# Altium schematic sheet TIDA-00641_BlankSheet.SchDoc
size 431 x 279 mm; Date: Not shown in title block; ApprovedBy: Not shown in title block; CheckedBy: Not shown in title block; Author: Not shown in title block; CompanyName: Not shown in title block; Engineer: Not shown in title block; Organization: Not shown in title block; Address1: Not shown in title block; Address2: Not shown in title block; Address3: Not shown in title block; Address4: Not shown in title block; DocumentNumber: 1; Revision: Use project parameter SCH_Rev; SheetNumber: 2; SheetTotal: 3; PageSetup: Record=PageOptions|CenterHorizontal=True|CenterVertical=True|PrintScale=1.00|XCorrection=1.00|YCorrection=1.00|PrintKind=0|BorderSize=5000000|LeftOffset=0|BottomOffset=0|Orientation=2|PaperLength=1000|PaperWidth=1000|Scale=100|PaperSource=15|PrintQuality=600|MediaType=1|DitherType=10|PaperKind=Letter|PrintScaleMode=1; CurrentTime: Not shown in title block; CurrentDate: Not shown in title block; Time: Not shown in title block; DocumentFullPathAndName: Not shown in title block; DocumentName: Not shown in title block; ModifiedDate: Not shown in title block; ImagePath: Not shown in title block
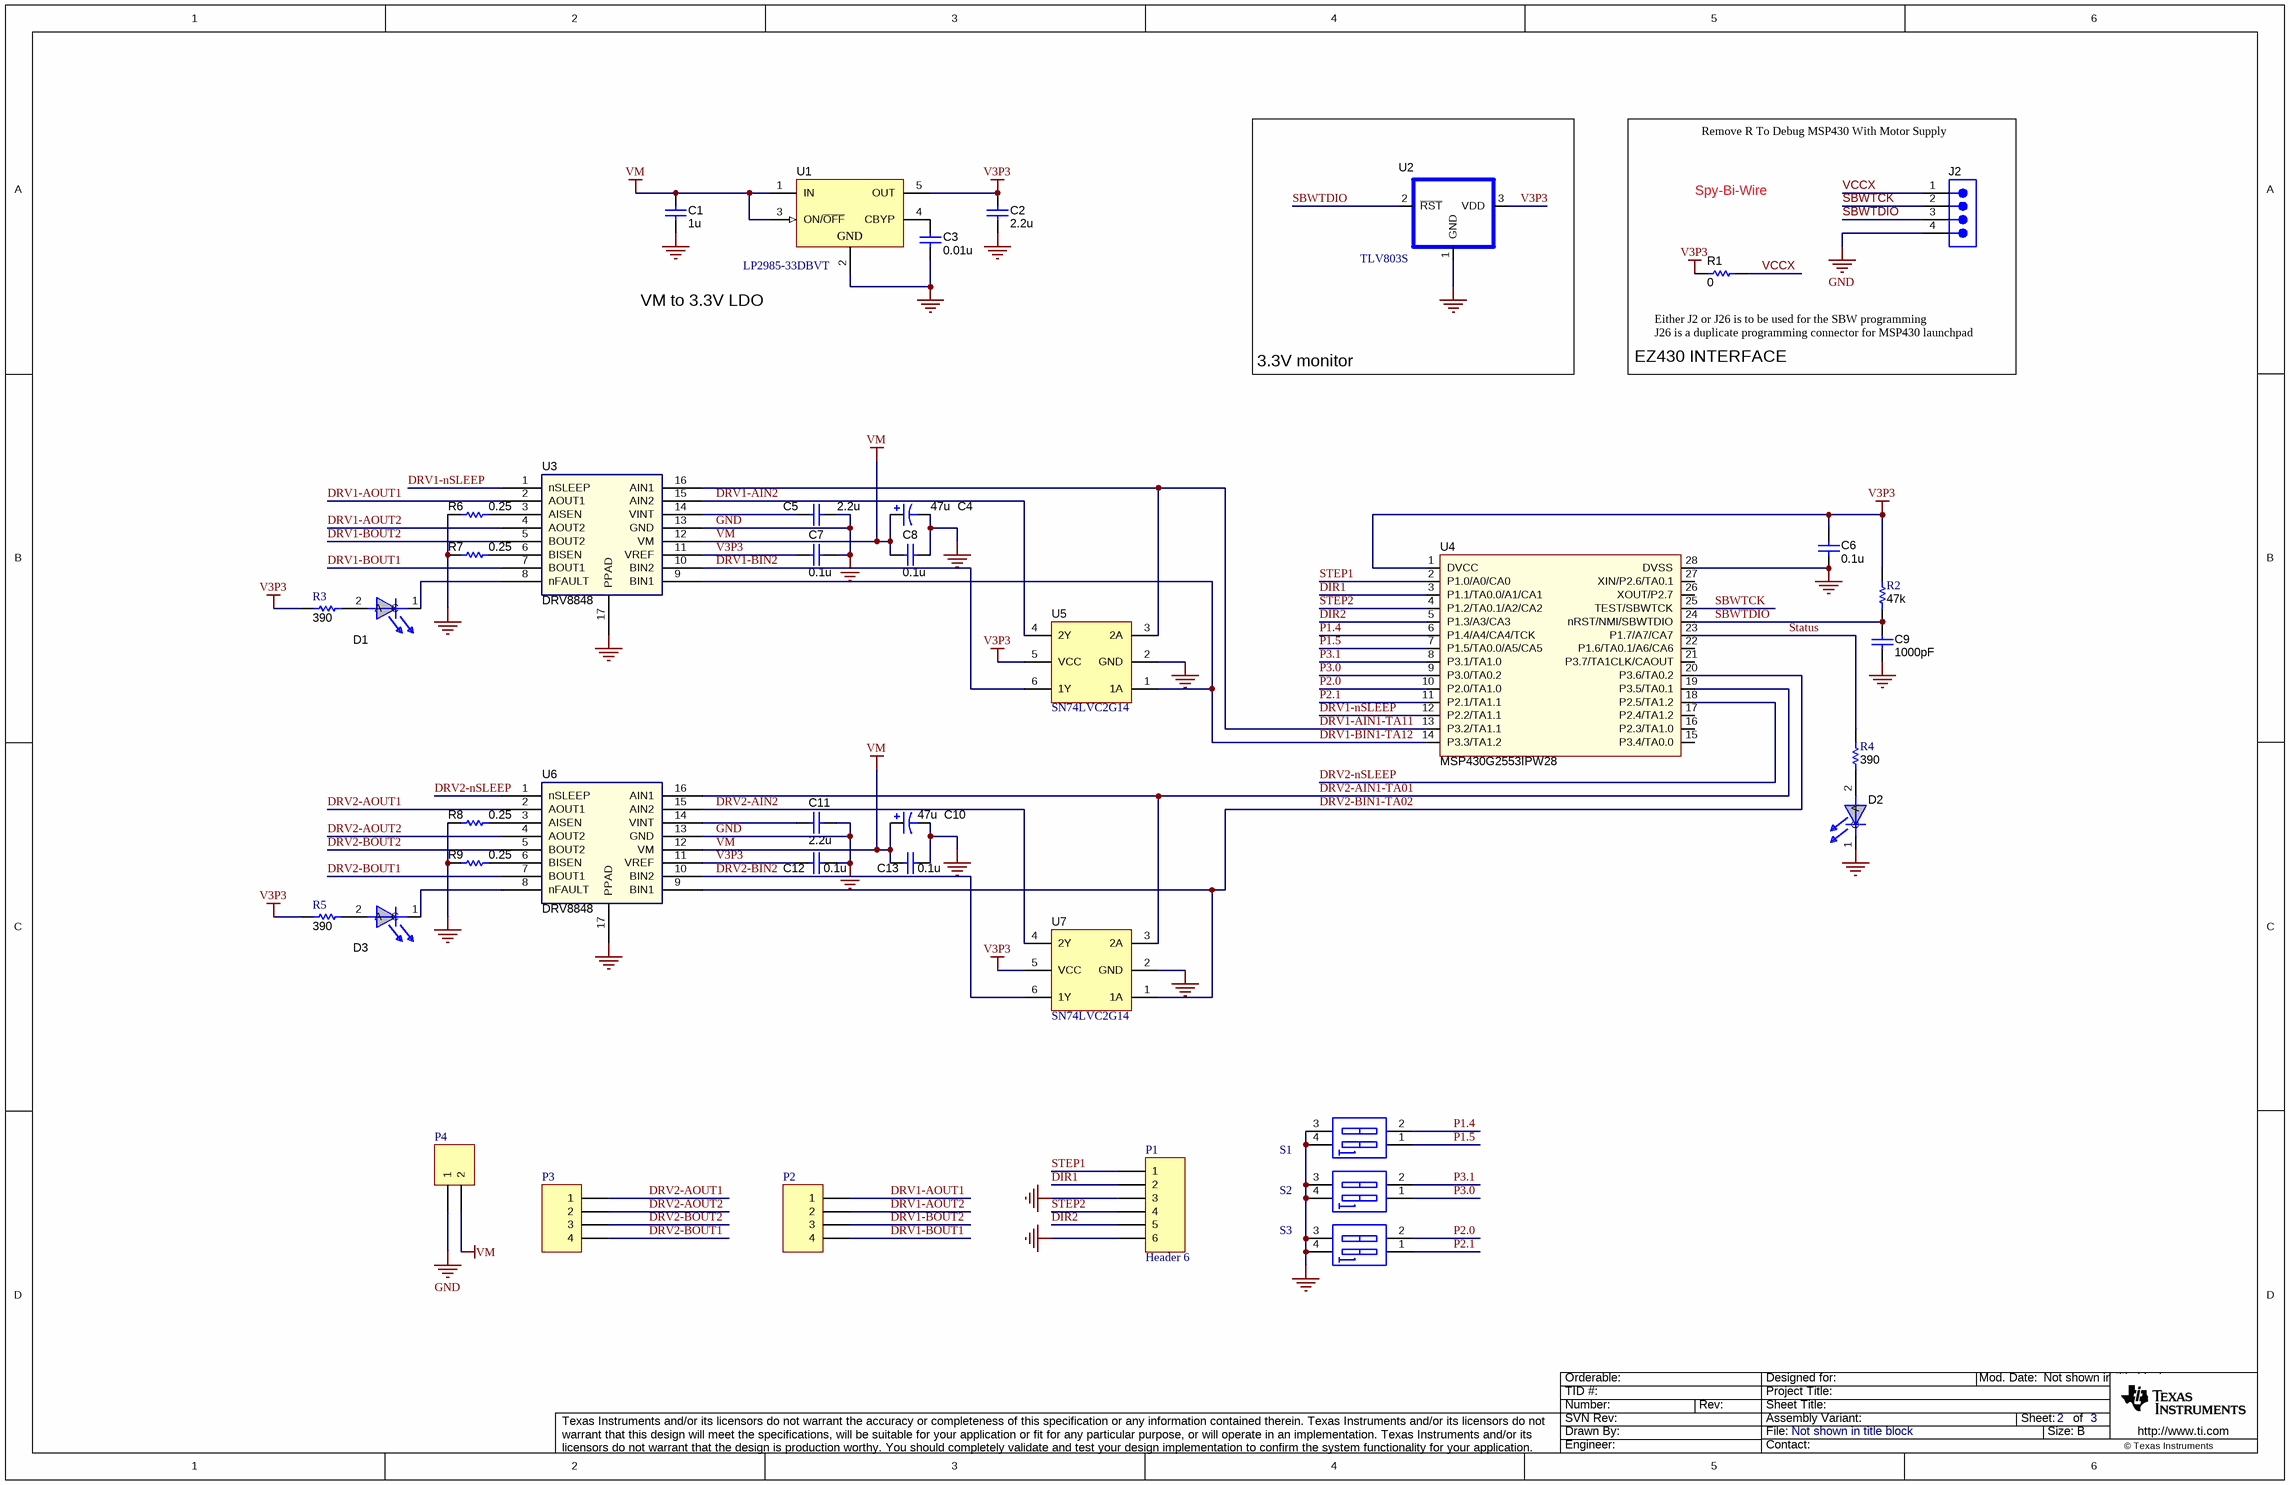
[diagram p0: TIDA-00641_BlankSheet.SchDoc]

## Parts
C1  ValueDisplayed: 1u  [0603L]  (hidden comment: C0603C105K4PACTU)
C2  ValueDisplayed: 2.2u  [0603L]  (hidden comment: C0603C225K8PACTU)
C3  ValueDisplayed: 0.01u  [0603L]  (hidden comment: C0603C103J5RACTU)
C4  ValueDisplayed: 47u  [SM_RADIAL_D]  (hidden comment: EEE-FK1E470P)
C5  ValueDisplayed: 2.2u  [0603L]  (hidden comment: C0603C225M8PACTU)
C6  ValueDisplayed: 0.1u  [0603L]  (hidden comment: C0603C104K4RACTU)
C7  ValueDisplayed: 0.1u  [0603L]  (hidden comment: 06033C104KAT2A)
C8  ValueDisplayed: 0.1u  [0603L]  (hidden comment: 06033C104KAT2A)
C9  ValueDisplayed: 1000pF  [0603L]  (hidden comment: C0603C102K5RACTU)
C10  ValueDisplayed: 47u  [SM_RADIAL_D]  (hidden comment: EEE-FK1E470P)
C11  ValueDisplayed: 2.2u  [0603L]  (hidden comment: C0603C225K8PACTU)
C12  ValueDisplayed: 0.1u  [0603L]  (hidden comment: 06033C104KAT2A)
C13  ValueDisplayed: 0.1u  [0603L]  (hidden comment: 06033C104KAT2A)
D1  LTST-C190KRKT  [LED603RED]  (value not drawn)
D2  LTST-C190GKT  [LED603GRN]  (value not drawn)
D3  LTST-C190KRKT  [LED603RED]  (value not drawn)
J2  TSW-104-07-G-S  [HDR1X4]  (value not drawn)
P1  Header 6  [HDR1X6]
P2  Header 4  [J4-3.81]  (value not drawn)
P3  Header 4  [J4-3.81]  (value not drawn)
P4  Header 2  [j2-3.81]  (value not drawn)
R1  value 0  [0603L]  (hidden comment: ERJ-3GEY0R00V)
R2  value 47k  [0603L]  (hidden comment: CRCW060347K0JNEA)
R3  value 390  [0603L]  (hidden comment: RC0603FR-07390RL)
R4  value 390  [0603L]  (hidden comment: RC0603FR-07390RL)
R5  value 390  [0603L]  (hidden comment: RC0603FR-07390RL)
R6  value 0.25  [2512M]  (hidden comment: CSRN2512FKR250)
R7  value 0.25  [2512M]  (hidden comment: CSRN2512FKR250)
R8  value 0.25  [2512M]  (hidden comment: CSRN2512FKR250)
R9  value 0.25  [2512M]  (hidden comment: CSRN2512FKR250)
S1  SW DIP-2  [DIP-4]  (value not drawn)
S2  SW DIP-2  [DIP-4]  (value not drawn)
S3  SW DIP-2  [DIP-4]  (value not drawn)
U1  LP2985-33DBVT  [MF05A_L]
U2  TLV803S  [SOT-23]
U3  DRV8848  [PW0016S]
U4  MSP430G2553IPW28  [PW0028A_N]
U5  SN74LVC2G14  [DBV0006A_N]
U6  DRV8848  [PW0016S]
U7  SN74LVC2G14  [DBV0006A_N]

## Blocks framed on the sheet
3.3V monitor: U2
EZ430 INTERFACE: J2 R1

## Nets
GND: C1.2 C2.1 C3.2 C4.2(-) C5.2 C6.1 C7.1 C8.1 C9.1 C10.2(-) C11.2 C12.1 C13.1 D2.1(C) J2.4 P1.3 P1.6 P4.1 R6.1 R7.1 R8.1 R9.1 S1.3(B2) S1.4(B1) S2.3(B2) S2.4(B1) S3.3(B2) S3.4(B1) U1.2(GND) U2.1(GND) U3.13(GND) U3.17(PPAD) U4.28(DVSS) U5.2(GND) U6.13(GND) U6.17(PPAD) U7.2(GND)
V3P3: C2.2 C6.2 C7.2 C12.2 R1.1 R2.1 R3.2 R5.2 U1.5(OUT) U2.3(VDD) U3.11(VREF) U4.1(DVCC) U5.5(VCC) U6.11(VREF) U7.5(VCC)
VM: C1.1 C4.1(+) C8.2 C10.1(+) C13.2 P4.2 U1.1(IN) U1.3(ON/~{OFF}) U3.12(VM) U6.12(VM)
DIR1: P1.2 U4.3(P1.1/TA0.0/A1/CA1)
DIR2: P1.5 U4.5(P1.3/A3/CA3)
DRV1-AIN1-TA11: U3.16(AIN1) U4.13(P3.2/TA1.1) U5.3(2A)
DRV1-AIN2: U3.15(AIN2) U5.4(2Y)
DRV1-AOUT1: P2.1 U3.2(AOUT1)
DRV1-AOUT2: P2.2 U3.4(AOUT2)
DRV1-BIN1-TA12: U3.9(BIN1) U4.14(P3.3/TA1.2) U5.1(1A)
DRV1-BIN2: U3.10(BIN2) U5.6(1Y)
DRV1-BOUT1: P2.4 U3.7(BOUT1)
DRV1-BOUT2: P2.3 U3.5(BOUT2)
DRV1-nSLEEP: U3.1(nSLEEP) U4.12(P2.2/TA1.1)
DRV2-AIN1-TA01: U4.19(P3.5/TA0.1) U6.16(AIN1) U7.3(2A)
DRV2-AIN2: U6.15(AIN2) U7.4(2Y)
DRV2-AOUT1: P3.1 U6.2(AOUT1)
DRV2-AOUT2: P3.2 U6.4(AOUT2)
DRV2-BIN1-TA02: U4.20(P3.6/TA0.2) U6.9(BIN1) U7.1(1A)
DRV2-BIN2: U6.10(BIN2) U7.6(1Y)
DRV2-BOUT1: P3.4 U6.7(BOUT1)
DRV2-BOUT2: P3.3 U6.5(BOUT2)
DRV2-nSLEEP: U4.18(P2.5/TA1.2) U6.1(nSLEEP)
P1.4: S1.2(A2) U4.6(P1.4/A4/CA4/TCK)
P1.5: S1.1(A1) U4.7(P1.5/TA0.0/A5/CA5)
P2.0: S3.2(A2) U4.10(P2.0/TA1.0)
P2.1: S3.1(A1) U4.11(P2.1/TA1.1)
P3.0: S2.1(A1) U4.9(P3.0/TA0.2)
P3.1: S2.2(A2) U4.8(P3.1/TA1.0)
SBWTCK: J2.2 U4.25(TEST/SBWTCK)
SBWTDIO: C9.2 J2.3 R2.2 U2.2(~{RST}) U4.24(nRST/NMI/SBWTDIO)
Status: R4.2 U4.23(P1.7/A7/CA7)
STEP1: P1.1 U4.2(P1.0/A0/CA0)
STEP2: P1.4 U4.4(P1.2/TA0.1/A2/CA2)
VCCX: J2.1 R1.2
NetC3_1: C3.1 U1.4(CBYP)
NetC5_1: C5.1 U3.14(VINT)
NetC11_1: C11.1 U6.14(VINT)
NetD1_1: D1.1(C) U3.8(nFAULT)
NetD1_2: D1.2(A) R3.1
NetD2_2: D2.2(A) R4.1
NetD3_1: D3.1(C) U6.8(nFAULT)
NetD3_2: D3.2(A) R5.1
NetR6_2: R6.2 U3.3(AISEN)
NetR7_2: R7.2 U3.6(BISEN)
NetR8_2: R8.2 U6.3(AISEN)
NetR9_2: R9.2 U6.6(BISEN)

Not connected (* = marked no-connect by the designer): U4 15(P3.4/TA0.0) 16(P2.3/TA1.0) 17(P2.4/TA1.2) 21(P3.7/TA1CLK/CAOUT) 22(P1.6/TA0.1/A6/CA6) 26(XOUT/P2.7) 27(XIN/P2.6/TA0.1)

## Notes on the sheet
- Remove R To Debug MSP430 With Motor Supply
- Spy-Bi-Wire
- VM to 3.3V LDO
- (near R1) Either J2 or J26 is to be used for the SBW programming
- J26 is a duplicate programming connector for MSP430 launchpad
- Drawn By:
- SVN Rev:
- Number:
- TID #:
- Orderable:
- Rev:
- Sheet Title:
- File:
- Project Title:
- Designed for:
- Assembly Variant:
- Mod. Date:
- Sheet:
- Size:
- of
- B
- http://www.ti.com
- Texas Instruments and/or its licensors do not warrant the accuracy or completeness of this specification or any information contained therein. Texas Instruments and/or its licensors do not warrant that this design will meet the specifications, will be suitable for your application or fit for any particular purpose, or will operate in an implementation. Texas Instruments and/or its licensors do not warrant that the design is production worthy. You should completely validate and test your design implementation to confirm the system functionality for your application.
- Engineer:
- Contact:
- © Texas Instruments

## Library data of the parts
C1 = C0603C105K4PACTU: CAP, CERM, 1uF, 16V, +/-10%, X5R, 0603; Manufacturer: Kemet; Polarized: N; CompType: Capacitor; U/M: EA; Cap_F: 0.000001; Tolerance_%: 10; Value1: Unknown; VDC_V: 16; TaMin_C: -55; TaMax_C: 85; Cap_Case: 0603; Value: 1uF; SymbolVersion: 2008-07-09; PartNumber: C0603C105K4PACTU; PackageReference: 0603; RoHS: Y; Value2: 16V; MountType: SMT; Technology: Ceramic; TempCo: X5R; Published: 2008-06-19; Publisher: Texas Instruments; LatestRevisionDate: 2013-03-13; ComponentLink1Description: Datasheet link; ComponentLink1URL: http://www.kemet.com/kemet/web/homepage/kechome.nsf/vapubfiles/F3102_Y5V.pdf/$file/F3102_Y5V.pdf; Supplier 1: Digi-Key; Supplier Part Number 1: 399-5090-1-ND; Supplier 2: Mouser; Supplier Part Number 2: 80-C0603C105K4P; Supplier 3: Farnell; Supplier Part Number 3: 1288256; LatestRevisionNote: Changed publisher
C2 C11 = C0603C225K8PACTU: CAP, CERM, 2.2uF, 10V, +/-10%, X5R, 0603; Manufacturer: Kemet; Polarized: N; CompType: Capacitor; U/M: EA; Cap_F: 0.0000022; Tolerance_%: 10; Value1: Unknown; TaMin_C: -55; TaMax_C: 85; Cap_Case: 0603; SymbolVersion: 2008-07-09; Value: 2.2uF; PartNumber: C0603C225K8PACTU; PackageReference: 0603; RoHS: Y; VDC_V: 10; Value2: 10V; MountType: SMT; Technology: Ceramic; TempCo: X5R; Published: 2008-06-19; Publisher: Texas Instruments; LatestRevisionDate: 2013-03-13; ComponentLink1Description: Datasheet link; ComponentLink1URL: http://www.kemet.com/kemet/web/homepage/kechome.nsf/vapubfiles/F3102_Y5V.pdf/$file/F3102_Y5V.pdf; Supplier 1: Digi-Key; Supplier Part Number 1: 399-4911-1-ND; Supplier 2: Mouser; Supplier Part Number 2: 80-C0603C225K8P; Supplier 3: Farnell; Supplier Part Number 3: 1108322; LatestRevisionNote: Changed publisher
C3 = C0603C103J5RACTU: CAP, CERM, 0.01uF, 50V, +/-5%, X7R, 0603; Manufacturer: Kemet; Polarized: N; CompType: Capacitor; U/M: EA; Cap_F: 0.00000001; Tolerance_%: 5; Value1: Unknown; VDC_V: 50; TaMin_C: -55; TaMax_C: 125; Cap_Case: 0603; Value: 0.01uF; SymbolVersion: 2008-07-09; PartNumber: C0603C103J5RACTU; PackageReference: 0603; RoHS: Y; Value2: 50V; MountType: SMT; Technology: Ceramic; TempCo: X7R; Published: 2008-06-19; Publisher: Texas Instruments; LatestRevisionDate: 2013-03-13; ComponentLink1Description: Datasheet link; ComponentLink1URL: http://www.kemet.com/kemet/web/homepage/kechome.nsf/vapubfiles/F3102_Y5V.pdf/$file/F3102_Y5V.pdf; Supplier 1: Digi-Key; Supplier Part Number 1: 399-1092-1-ND; Supplier 2: Mouser; Supplier Part Number 2: 80-C0603C103J5R; Supplier 3: Farnell; Supplier Part Number 3: 1650831; LatestRevisionNote: Changed publisher
C4 C10 = EEE-FK1E470P: CAP, AL, 47uF, 25V, +/-20%, 0.36 ohm, SMD; Manufacturer: Panasonic; Polarized: Y; CompType: Capacitor; U/M: EA; Cap_F: 0.000047; Tolerance_%: 20; ESR_Ohm: 0.36; VDC_V: 25; IRMS_A: 0.24; TaMin_C: -55; TaMax_C: 105; Cap_Case: D; LatestRevisionDate: 2013-03-19; PackageReference: SMT Radial D; Publisher: Texas Instruments; Value: 47uF; SymbolVersion: 2008-07-09; PartNumber: EEE-FK1E470P; RoHS: Y; Value1: 0.36 ohm; Value2: 25V; MountType: SMT; Technology: AL; ComponentLink1Description: Datasheet link; ComponentLink1URL: http://www.panasonic.com/industrial/components/pdf/smt_aec_050505.pdf; Supplier 1: Digi-Key; Supplier Part Number 1: PCE3804CT-ND; Supplier 2: Mouser; Supplier Part Number 2: 667-EEE-FK1E470P; Supplier 3: Farnell; Supplier Part Number 3: 9695753; Series: FK
C5 = C0603C225M8PACTU: CAP, CERM, 2.2uF, 10V, +/-20%, X5R, 0603; Manufacturer: Kemet; Polarized: N; CompType: Capacitor; U/M: EA; Cap_F: 0.0000022; Tolerance_%: 20; Value1: Unknown; VDC_V: 10; TaMin_C: -55; TaMax_C: 85; Cap_Case: 0603; SymbolVersion: 2008-07-09; Value: 2.2uF; PartNumber: C0603C225M8PACTU; PackageReference: 0603; RoHS: Y; Value2: 10V; MountType: SMT; Technology: Ceramic; TempCo: X5R; Published: 2008-06-19; Publisher: Texas Instruments; LatestRevisionDate: 2013-03-13; ComponentLink1Description: Datasheet link; ComponentLink1URL: http://www.kemet.com/kemet/web/homepage/kechome.nsf/vapubfiles/F3102_Y5V.pdf/$file/F3102_Y5V.pdf; Supplier 1: Digi-Key; Supplier Part Number 1: 399-4912-1-ND; Supplier 2: Mouser; Supplier Part Number 2: 80-C0603C225M8P; LatestRevisionNote: Changed publisher
C6 = C0603C104K4RACTU: CAP, CERM, 0.1uF, 16V, +/-10%, X7R, 0603; Manufacturer: Kemet; Polarized: N; CompType: Capacitor; U/M: EA; Cap_F: 0.0000001; Tolerance_%: 10; Value1: Unknown; VDC_V: 16; TaMin_C: -55; TaMax_C: 125; Cap_Case: 0603; Value: 0.1uF; SymbolVersion: 2008-07-09; PartNumber: C0603C104K4RACTU; PackageReference: 0603; RoHS: Y; Value2: 16V; MountType: SMT; Technology: Ceramic; TempCo: X7R; Published: 2008-06-19; Publisher: Texas Instruments; LatestRevisionDate: 2013-03-13; ComponentLink1Description: Datasheet link; ComponentLink1URL: http://www.kemet.com/kemet/web/homepage/kechome.nsf/vapubfiles/F3102_Y5V.pdf/$file/F3102_Y5V.pdf; Supplier 1: Digi-Key; Supplier Part Number 1: 399-1096-1-ND; Supplier 2: Mouser; Supplier Part Number 2: 80-C0603C104K4R; Supplier 3: Farnell; Supplier Part Number 3: 1414610; LatestRevisionNote: Changed publisher
C7 C8 C12 C13 = 06033C104KAT2A: CAP, CERM, 0.1uF, 25V, +/-10%, X7R, 0603; Manufacturer: AVX; Polarized: N; CompType: Capacitor; U/M: EA; Cap_F: 0.0000001; Tolerance_%: 10; ESR_Ohm: 0.05; Value1: 0.05 ohm; VDC_V: 25; TaMin_C: -55; TaMax_C: 125; Cap_Case: 0603; Value: 0.1uF; SymbolVersion: 2008-07-09; PartNumber: 06033C104KAT2A; PackageReference: 0603; RoHS: Y; Value2: 25V; MountType: SMT; Technology: Ceramic; TempCo: X7R; Published: 2008-06-19; Publisher: Texas Instruments; LatestRevisionDate: 2013-03-13; ComponentLink1Description: Datasheet link; ComponentLink1URL: http://www.avx.com/docs/masterpubs/smccp.pdf; Supplier 1: Digi-Key; Supplier Part Number 1: 478-3714-1-ND; Supplier 2: Mouser; Supplier Part Number 2: 581-06033C104KAT2A; Supplier 3: Farnell; Supplier Part Number 3: 1396406; LatestRevisionNote: Changed publisher
C9 = C0603C102K5RACTU: CAP, CERM, 1000pF, 50V, +/-10%, X7R, 0603; Manufacturer: Kemet; Polarized: N; CompType: Capacitor; U/M: EA; Cap_F: 0.000000001; Tolerance_%: 10; Value1: Unknown; VDC_V: 50; TaMin_C: -55; TaMax_C: 125; Cap_Case: 0603; Value: 1000pF; SymbolVersion: 2008-07-09; PartNumber: C0603C102K5RACTU; PackageReference: 0603; RoHS: Y; Value2: 50V; MountType: SMT; Technology: Ceramic; TempCo: X7R; Published: 2008-06-19; Publisher: Texas Instruments; LatestRevisionDate: 2013-03-13; ComponentLink1Description: Datasheet link; ComponentLink1URL: http://www.kemet.com/kemet/web/homepage/kechome.nsf/vapubfiles/F3102_Y5V.pdf/$file/F3102_Y5V.pdf; Supplier 1: Digi-Key; Supplier Part Number 1: 399-1082-1-ND; Supplier 2: Mouser; Supplier Part Number 2: 80-C0603C102K5R; Supplier 3: Farnell; Supplier Part Number 3: 1414608; LatestRevisionNote: Changed publisher
D1 D3 = D_LED_603_GRN: LED SUPER RED CLEAR 0603 SMD; Manufacturer: Lite On; Value: LTST-C190GKT; Area: 9451; PartNumber: LTST-C190KRKT; SymbolVersion: 11/01/2006 14:12:06; PackageReference: 603; ComponentLink1URL: \\vette02\pmp_pcb\pcad_pdf's\c190.pdf; ComponentLink1Description: AEO Datasheet Link; ComponentHeight: 0.031 inch; Supplier 1: Digi-key; Supplier Part Number 1: 160-1436-1-ND
D2 = D_LED_603_GRN: Diode, LED, Green, 2.1-V, 20-mA, 6-mcd; Manufacturer: Lite On; Area: 9451; PartNumber: LTST-C190GKT; SymbolVersion: 11/01/2006 14:12:06; Value: LTST-C190GKT; PackageReference: 603; ComponentLink1URL: \\vette02\pmp_pcb\pcad_pdf's\c190.pdf; ComponentLink1Description: AEO Datasheet Link; ComponentHeight: 0.031 inch; Supplier 1: Digi-key; Supplier Part Number 1: 160-1183-1-ND
J2 = TSW-104-07-G-S: Header, TH, 100mil, 4x1, Gold plated, 230 mil above insulator; Manufacturer: Samtec, Inc.; SymbolCreator: a0412235; U/M: EA; LatestRevisionDate: 2013-03-28; Publisher: Texas Instruments; SymbolVersion: 2013-03-16; PartNumber: TSW-104-07-G-S; ClassName: Header; CompType: Header; RoHS: Y; PackageReference: TSW-104-07-G-S; MountType: TH; ComponentLink1Description: Datasheet Link; ComponentLink1URL: http://samtec.com/ftppub/pdf/TSW_TH.PDF; Supplier 1: Digi-Key; Supplier Part Number 1: SAM1029-04-ND
P1 = Header 6: Header, 6-Pin; LatestRevisionDate: 17-Jul-2002; LatestRevisionNote: Re-released for DXP Platform.; Publisher: Altium Limited
P2 P3 = Header 4: Header, 4-Pin; LatestRevisionDate: 17-Jul-2002; LatestRevisionNote: Re-released for DXP Platform.; Publisher: Altium Limited
P4 = Header 2: Header, 2-Pin; LatestRevisionDate: 17-Jul-2002; LatestRevisionNote: Re-released for DXP Platform.; Publisher: Altium Limited
R1 = ERJ-3GEY0R00V: RES, 0 ohm, 5%, 0.1W, 0603; Manufacturer: Panasonic; CompType: Resistor; Value_Code: 0000; Tolerance_%: 5; Power_W: 0.1; VDC_V: 50; TempCo: 600 ppm/C; EIA_Code: E24; U/M: EA; SymbolVersion: 2009-05-29; PartNumber: ERJ-3GEY0R00V; PackageReference: 0603; RoHS: Y; Res_ohm: 0; Value1: 5%; Value2: 0.1W; MountType: SMT; Technology: Thick Film; Published: 2008-06-26; Publisher: Texas Instruments; LatestRevisionDate: 2013-01-08; ComponentLink1Description: Datasheet link; ComponentLink1URL: http://www.panasonic.com/industrial/components/pdf/AOA0000CE1.pdf; Supplier 1: Digi-Key; Supplier Part Number 1: P0.0GCT-ND; Supplier 2: Mouser; Supplier Part Number 2: 667-ERJ-3GEY0R00V; Supplier 3: Farnell; Supplier Part Number 3: 2059527
R2 = CRCW060347K0JNEA: RES, 47k ohm, 5%, 0.1W, 0603; Manufacturer: Vishay-Dale; CompType: Resistor; Res_ohm: 47000; Value_Code: 47k0; Tolerance_%: 5; Power_W: 0.1; VDC_V: 75; TempCo: 200 ppm/C; EIA_Code: E24; U/M: EA; SymbolVersion: 2009-05-29; PartNumber: CRCW060347K0JNEA; PackageReference: 0603; RoHS: Y; Value1: 5%; Value2: 0.1W; MountType: SMT; Technology: Thick Film; Published: 2008-06-26; Publisher: Texas Instruments; LatestRevisionDate: 2014-01-08; ComponentLink1Description: Datasheet link; ComponentLink1URL: http://www.vishay.com/docs/20035/dcrcwe3.pdf; Supplier 1: Digi-Key; Supplier Part Number 1: 541-47KGCT-ND; Supplier 2: Mouser; Supplier Part Number 2: 71-CRCW060347K0JNEA; Supplier 3: Farnell; Supplier Part Number 3: 1652881
R3-R5 = RC0603FR-07390RL: RES, 390 ohm, 1%, 0.1W, 0603; Manufacturer: Yageo America; CompType: Resistor; Value_Code: 390R; Tolerance_%: 1; Power_W: 0.1; VDC_V: 150; TempCo: 200 ppm/C; U/M: EA; SymbolVersion: 2009-05-29; PartNumber: RC0603FR-07390RL; PackageReference: 0603; RoHS: Y; Res_ohm: 390; Value1: 1%; Value2: 0.1W; MountType: SMT; Technology: Thick Film; Published: 2008-06-26; Publisher: Texas Instruments; LatestRevisionDate: 2014-01-08; ComponentLink1Description: Datasheet link; ComponentLink1URL: http://www.yageo.com/pdf/Pu-RC0603_51_PbFree_L_2.pdf; Supplier 1: Digi-Key; Supplier Part Number 1: 311-390HRCT-ND; Supplier 2: Mouser; Supplier Part Number 2: 603-RC0603FR-07390RL; Supplier 3: Farnell; Supplier Part Number 3: 9238433
R6-R9 = CSRN2512FKR250: RES, 0.25 ohm, 1%, 2W, 2512; Manufacturer: Stackpole Electronics Inc; CompType: Resistor; Value_Code: R250; Tolerance_%: 1; Power_W: 2; TempCo: 200 ppm/C; U/M: EA; SymbolVersion: 2009-05-29; PartNumber: CSRN2512FKR250; PackageReference: 2512; RoHS: Y; Res_ohm: 0.25; Value1: 1%; Value2: 2W; MountType: SMT; Technology: Thick Film; Published: 2008-06-26; Publisher: Texas Instruments; LatestRevisionDate: 2013-12-20; ComponentLink1Description: Datasheet link; ComponentLink1URL: http://www.seielect.com/Catalog/SEI-csr.pdf; Supplier 1: Digi-Key; Supplier Part Number 1: CSRN2512FKR250CT-ND
S1-S3 = SW DIP-2: SWITCH TIN CONT 2 SEC 50V; Published: 24-Mar-1999; LatestRevisionDate: 17-Jul-2002; LatestRevisionNote: Re-released for DXP Platform.; PackageReference: DIP-4; Publisher: Altium Limited; Supplier 1: Digi-key; Supplier Part Number 1: CT2082-ND
U1 = LP2985IM5-3.3: Micropower 150 mA Low-Noise Ultra Low-Dropout Regulator, 5-pin SOT-23; Manufacturer: National Semiconductor; PackageTopMarking: L0RB*XTT; PowerWise: N; CompType: LDO IC; Publisher: Altium Limited; Published: 4-Dec-2008; DatasheetVersion: Jul-2007; PackageVersion: revD, Aug-2008; PackageReference: MF05A; PackageDescription: Molded SOT-23, .115 x .063 x .040 in Body, 5 Lead, .0375 in Pitch; Supplier 1: Farnell; Supplier Part Number 1: 9778284; PartNumber: LP2985IM5-3.3; RoHS: N; PinCount: 5; ComponentLink1Description: LP2985 Datasheet; ComponentLink1URL: http://www.national.com/ds/LP/LP2985.pdf; ComponentLink2Description: LP2985 Web Page; ComponentLink2URL: http://www.national.com/pf/LP/LP2985.html; ComponentLink3Description: MF05A Package Page; ComponentLink3URL: http://www.national.com/packaging/folders/mf05a.html
U2 = TLV803DBZ: IC VOLT SUPERVISR 2.93V SOT23-3; Manufacturer: TI; PartNumber: TLV803SDBZR; Alternate Manufacturer: None; Area: 28050; Value: TLV803xDBZ; SymbolVersion: 02/28/2011 15:41:24; ComponentLink1URL: \\vette02\pmp_pcb\pcad_pdf's\TLV803_PS_V1p0.pdf; PackageReference: SOT-23; ComponentLink1Description: AEO Datasheet Link; Supplier 1: Digi-key; Supplier Part Number 1: 296-29196-1-ND
U3 U6 = DRV8848PWP: IC MOTOR DRIVER PAR 16HTSSOP; Manufacturer: Used in BOM report; Manufacturer: Texas Instruments; SymbolVersion: use current date i.e. 2008-05-20; SymbolCreator: Use a-id; CompType: Used in some BOM reports.  Useful for finding later.; U/M: EA, IN, or GM; MountType: SMT, TH, or N/A; RoHS: Used in BOM report.  Use Y or N.; PartNumber: Used in BOM report; PackageReference: PWP0016; ComponentLink1Description: Datasheet Link; Alternate PartNumber: -; Alternate Manufacturer: -; Supplier 1: Digi-key; Supplier Part Number 1: 296-38514-5-ND; PartNumber: DRV8848PWP
U4 = MSP430G2553IPW28: IC MCU 16BIT 16KB FLASH 28TSSOP; Manufacturer: TI; Alternate Manufacturer: None; Area: 92800; SymbolVersion: 04/25/2011 15:40:58; PartNumber: MSP430G2553IPW28; ComponentLink1URL: \\vette02\pmp_pcb\pcad_pdf's\msp430g2553.pdf; PackageReference: TSSOP-28; Value: MSP430G2553IPW28; ComponentLink1Description: AEO Datasheet Link; Supplier 1: Digi-key; Supplier Part Number 1: 296-28431-1-ND
U5 U7 = SN74LVC2G14: Dual Schmitt-Trigger Inverter; Manufacturer: Texas Instruments; PartNumber: SN74LVC2G14DBVR; PackageReference: DBV0006A; PackageDescription: 6-Pin Plastic Small-Outline Package, 2.9 x 1.6 mm Body, 0.95 mm Pitch, 2.8 mm Lead Span; Supplier 1: Digi-Key; Supplier Part Number 1: 296-13010-1-ND; Supplier 2: Digi-Key; Supplier Part Number 2: 296-13010-1-ND; Supplier 3: Digi-Key; Supplier Part Number 3: 296-13010-1-ND; MountType: SMT